# EAGLE design ASD2411 (EAGLE 6.3)
DATABASE: ./../../../../../Components/TinyCircuits_Part_Database.txt
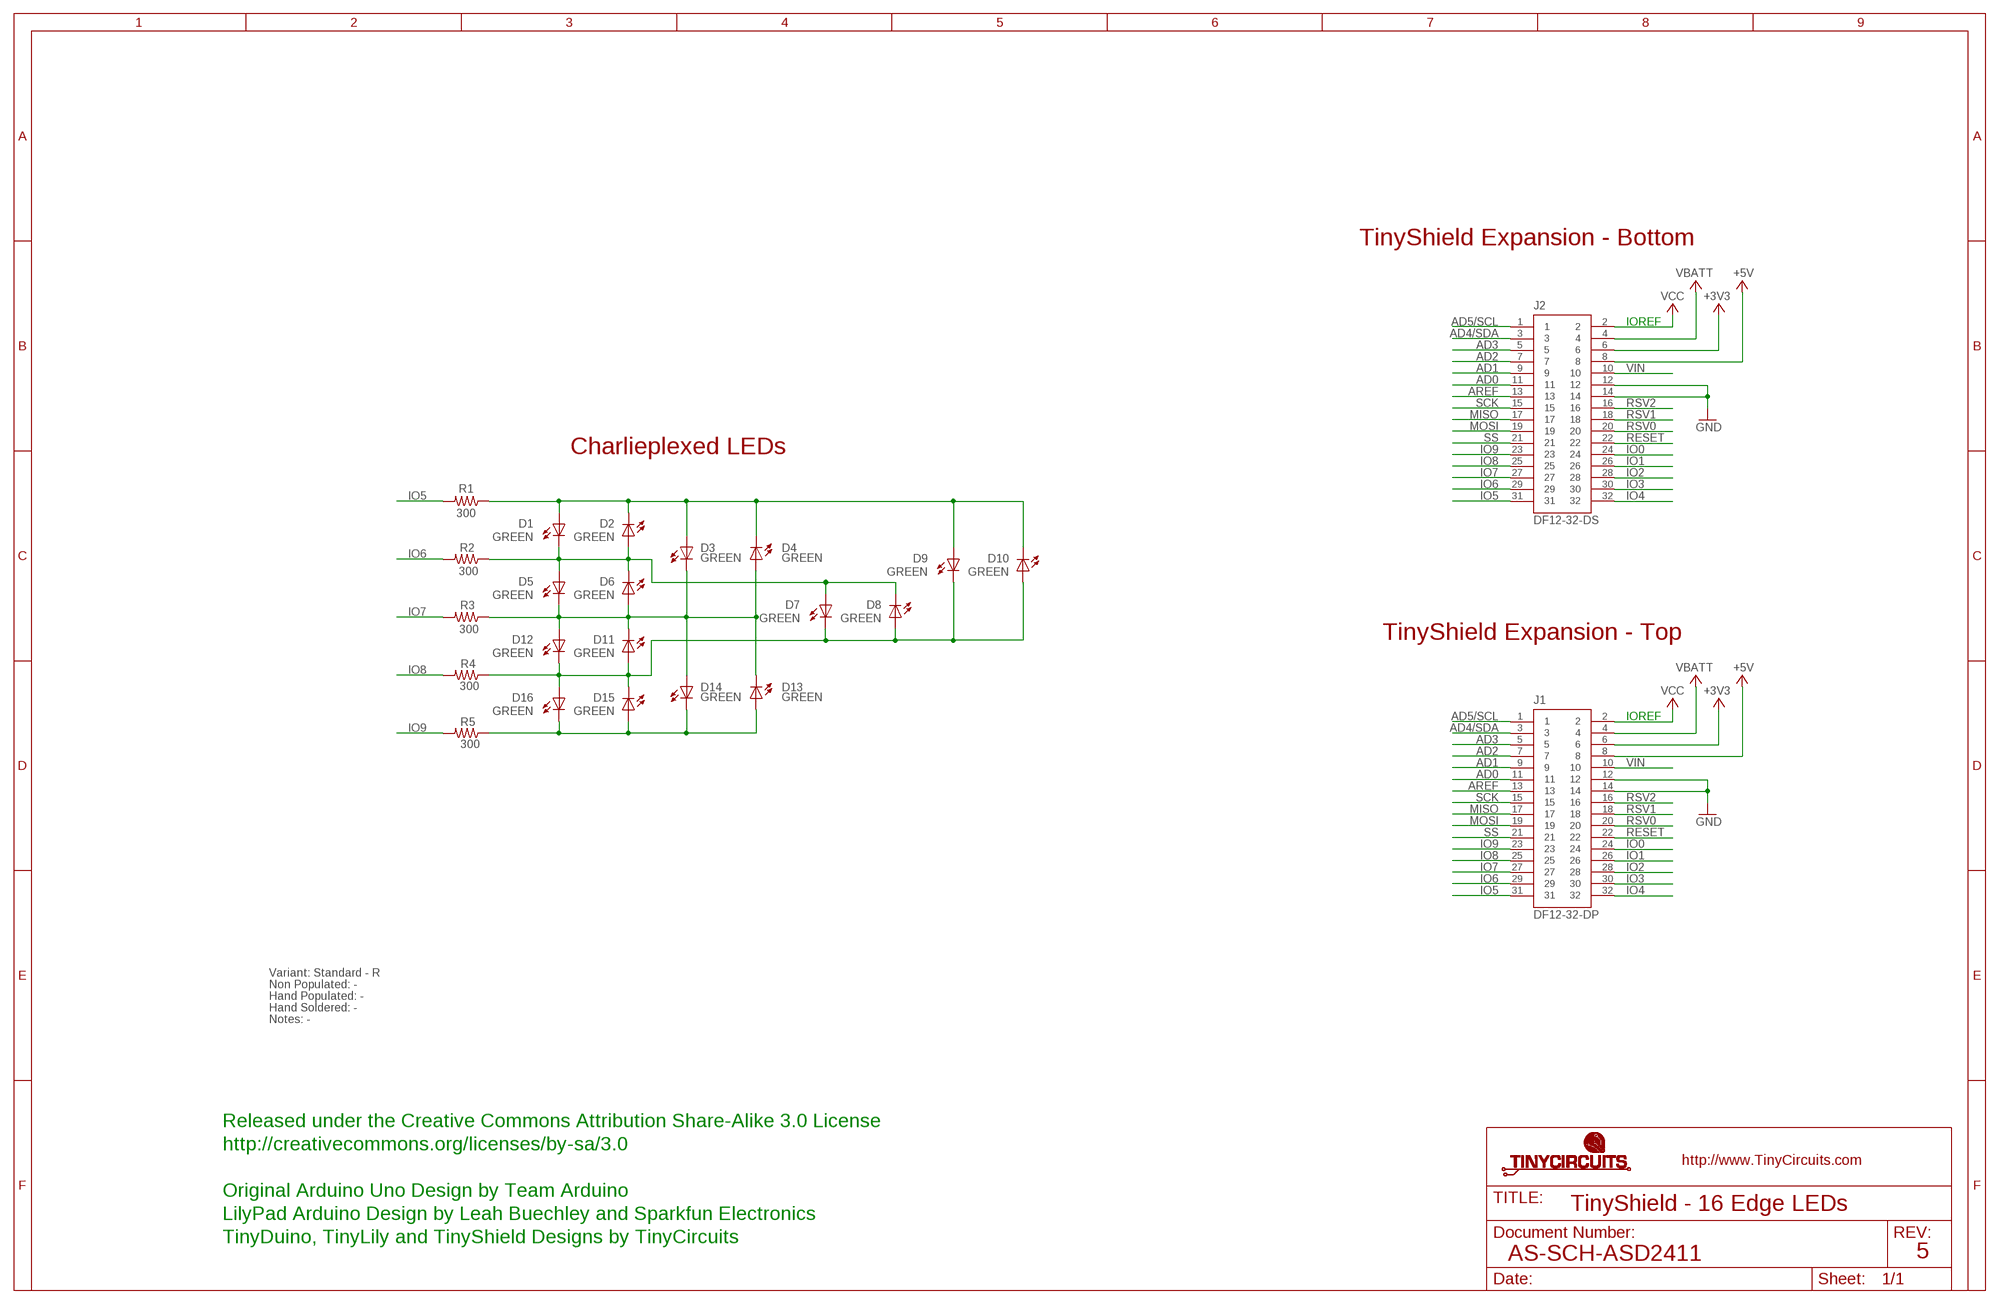
[diagram p0: schematic, sheet 1]

## Parts
D1  GREEN  AS-ITM-00011  [LNJ_LED]
D2  GREEN  AS-ITM-00011  [LNJ_LED]
D3  GREEN  AS-ITM-00011  [LNJ_LED]
D4  GREEN  AS-ITM-00011  [LNJ_LED]
D5  GREEN  AS-ITM-00011  [LNJ_LED]
D6  GREEN  AS-ITM-00011  [LNJ_LED]
D7  GREEN  AS-ITM-00011  [LNJ_LED]
D8  GREEN  AS-ITM-00011  [LNJ_LED]
D9  GREEN  AS-ITM-00011  [LNJ_LED]
D10  GREEN  AS-ITM-00011  [LNJ_LED]
D11  GREEN  AS-ITM-00011  [LNJ_LED]
D12  GREEN  AS-ITM-00011  [LNJ_LED]
D13  GREEN  AS-ITM-00011  [LNJ_LED]
D14  GREEN  AS-ITM-00011  [LNJ_LED]
D15  GREEN  AS-ITM-00011  [LNJ_LED]
D16  GREEN  AS-ITM-00011  [LNJ_LED]
J1  DF12-32-DP  AS-ITM-00015  [DF12-32-DP]
J2  DF12-32-DS  AS-ITM-00012  [DF12-32-DS]
R1  300  AS-ITM-00016  [0402]
R2  300  AS-ITM-00016  [0402]
R3  300  AS-ITM-00016  [0402]
R4  300  AS-ITM-00016  [0402]
R5  300  AS-ITM-00016  [0402]

## Nets
+3V3: J1.6 J2.6
+5V: J1.8 J2.8
AD0: J1.11 J2.11
AD1: J1.9 J2.9
AD2: J1.7 J2.7
AD3: J1.5 J2.5
AD4/SDA: J1.3 J2.3
AD5/SCL: J1.1 J2.1
AREF: J1.13 J2.13
GND: J1.12 J1.14 J2.12 J2.14
IO0: J1.24 J2.24
IO1: J1.26 J2.26
IO2: J1.28 J2.28
IO3: J1.30 J2.30
IO4: J1.32 J2.32
IO5: J1.31 J2.31 R1.2
IO6: J1.29 J2.29 R2.2
IO7: J1.27 J2.27 R3.2
IO8: J1.25 J2.25 R4.2
IO9: J1.23 J2.23 R5.2
MISO: J1.17 J2.17
MOSI: J1.19 J2.19
N$1: D1.C D2.A D5.A D6.C D7.A D8.C R2.1
N$11: D1.A D2.C D3.A D4.C D9.A D10.C R1.1
N$13: D3.C D4.A D5.C D6.A D11.C D12.A D13.C D14.A R3.1
N$14: D7.C D8.A D9.C D10.A D11.A D12.C D15.C D16.A R4.1
N$15: D13.A D14.C D15.A D16.C R5.1
RESET: J1.22 J2.22
RSV0: J1.20 J2.20
RSV1: J1.18 J2.18
RSV2: J1.16 J2.16
SCK: J1.15 J2.15
SS: J1.21 J2.21
VBATT: J1.4 J2.4
VCC: J1.2 J2.2
VIN: J1.10 J2.10

## Notes on the sheet
- TinyShield Expansion - Bottom
- IOREF
- Charlieplexed LEDs
- TinyShield Expansion - Top
- IOREF
- Variant: Standard - R
- Non Populated: -
- Hand Populated: -
- Hand Soldered: -
- Notes: -
- Released under the Creative Commons Attribution Share-Alike 3.0 License
- http://creativecommons.org/licenses/by-sa/3.0
- Original Arduino Uno Design by Team Arduino
- TinyShield - 16 Edge LEDs
- LilyPad Arduino Design by Leah Buechley and Sparkfun Electronics
- TinyDuino, TinyLily and TinyShield Designs by TinyCircuits
- AS-SCH-ASD2411 | 5

## Library data of the parts
D1-D16 = tinycircuits:AS-ITM-00011: LED GREEN SIDE VIEW SMD; PARTNO: AS-ITM-00011; PNPROTATION: 90
J1 = tinycircuits:AS-ITM-00015: CONN HEADER 32POS 3MM SMD 0.5MM; PARTNO: AS-ITM-00015
J2 = tinycircuits:AS-ITM-00012: CONN RECEPT 32POS 3MM SMD 0.5MM; PARTNO: AS-ITM-00012
R1-R5 = tinycircuits:AS-ITM-00016: RES 300 OHM 1/16W 1% 0402; PARTNO: AS-ITM-00016

## Board
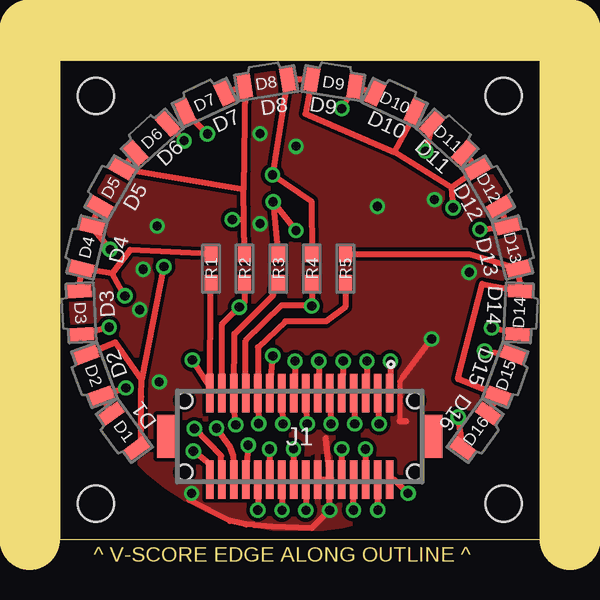
[diagram p1: board, top side]
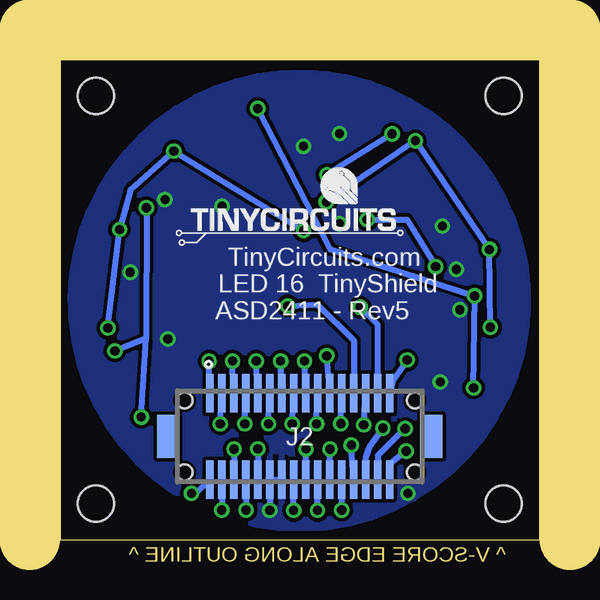
[diagram p2: board, bottom side, seen from below]

Size 20 x 20 mm. Coordinates in mm from the lower left corner, seen from the top.
Outline: 0,20 20,20 20,0 0,0 0,20
Copper layers (1*16): Top 0.035mm / dielectric 1.5mm / Bottom 0.035mm
Design rules "default *": minimum track width 8mil, minimum drill 15mil, track to track 6mil, track to pad 6mil, pad to pad 6mil, via to via 6mil, smd to smd 6mil, copper to edge 6mil, drill to drill 8mil, minimum pad ring 10mil, minimum via ring 5mil, stop-mask expansion 4mil, vias tented up to drill 25mil, thermal gap 10mil
Holes 1.5 mm at 1.5,18.5 18.5,18.5 18.5,1.5 1.5,1.5
tRestrict: 1 lines
bRestrict: 1 lines
Milling: 3 lines

### Footprints (pad centres in the part's own frame; a part is rotated, then mirrored left to right if it is on the bottom)
LNJ_LED = smd 1 x 0.55: A 0,0.9; C 0,-0.9
DF12-32-DP = smd 0.3 x 1.6: 1 -3.75,-1.8; 2 -3.75,1.8; 3 -3.25,-1.8; 4 -3.25,1.8; 5 -2.75,-1.8; 6 -2.75,1.8; 7 -2.25,-1.8; 8 -2.25,1.8; 9 -1.75,-1.8; 10 -1.75,1.8; 11 -1.25,-1.8; 12 -1.25,1.8; 13 -0.75,-1.8; 14 -0.75,1.8; 15 -0.25,-1.8; 16 -0.25,1.8; 17 0.25,-1.8; 18 0.25,1.8; 19 0.75,-1.8; 20 0.75,1.8; 21 1.25,-1.8; 22 1.25,1.8; 23 1.75,-1.8; 24 1.75,1.8; 25 2.25,-1.8; 26 2.25,1.8; 27 2.75,-1.8; 28 2.75,1.8; 29 3.25,-1.8; 30 3.25,1.8; 31 3.75,-1.8; 32 3.75,1.8 | smd 0.9 x 1.8: F1 -5.5,0; F2 5.5,0 | hole 0.65: -4.8,1.5; 4.8,1.5
DF12-32-DS = smd 0.3 x 1.6: 1 -3.75,1.8; 2 -3.75,-1.8; 3 -3.25,1.8; 4 -3.25,-1.8; 5 -2.75,1.8; 6 -2.75,-1.8; 7 -2.25,1.8; 8 -2.25,-1.8; 9 -1.75,1.8; 10 -1.75,-1.8; 11 -1.25,1.8; 12 -1.25,-1.8; 13 -0.75,1.8; 14 -0.75,-1.8; 15 -0.25,1.8; 16 -0.25,-1.8; 17 0.25,1.8; 18 0.25,-1.8; 19 0.75,1.8; 20 0.75,-1.8; 21 1.25,1.8; 22 1.25,-1.8; 23 1.75,1.8; 24 1.75,-1.8; 25 2.25,1.8; 26 2.25,-1.8; 27 2.75,1.8; 28 2.75,-1.8; 29 3.25,1.8; 30 3.25,-1.8; 31 3.75,1.8; 32 3.75,-1.8 | smd 0.9 x 1.8: F1 -5.5,0; F2 5.5,0 | hole 0.65: -4.8,1.5; 4.8,1.5
0402 = smd 0.65 x 0.55: 1 -0.6,0; 2 0.6,0

### Placement (x,y rotation side)
D1  2.66,4.53 36 top
D2  1.41,6.85 20 top
D3  0.86,9.46 3 top
D4  1.11,12.18 346 top
D5  2.12,14.67 330 top
D6  3.82,16.73 312 top
D7  6.03,18.23 295 top
D8  8.6,19.05 279 top
D9  11.4,19.05 261 top
D10  13.97,18.23 245 top
D11  16.18,16.73 228 top
D12  17.88,14.67 210 top
D13  18.89,12.18 194 top
D14  19.14,9.46 177 top
D15  18.59,6.85 160 top
D16  17.34,4.53 144 top
J1  10,4.3 180 top
J2  10,4.3 0 bottom
R1  6.3,11.3 270 top
R2  7.7,11.3 270 top
R3  9.1,11.3 270 top
R4  10.5,11.3 270 top
R5  11.9,11.3 270 top
U$1  [DOCFIELD-TINYCIRCUITS-PCB]  33.91,-10 0 top  (outside the outline)

### Tracks (layer width: path | path; a pad name or v marks a point on that pad's centre or on a via)
+3V3  (via drill 0.38)
  Top 0.254: J2.6 v12.75,3.77 v12.74,3.77
  Bottom 0.254: v12.74,3.77 12.74,2.51 J2.6
+5V  (via drill 0.38)
  Top 0.254: v12.24,1.23 J2.8
  Bottom 0.254: J2.8 12.25,1.21 v12.24,1.23
AD0  (via drill 0.38)
  Top 0.254: v11.3,4.83 11.31,5.05 J2.11
  Bottom 0.254: J2.11 11.28,5.79 v11.3,4.83
AD1  (via drill 0.38)
  Top 0.254: J2.9 11.79,6.27 v11.81,7.44
  Bottom 0.254: v11.81,7.44 11.78,6.22 J2.9
AD2  (via drill 0.38)
  Top 0.254: v12.29,4.83 12.31,5.05 J2.7
  Bottom 0.254: J2.7 12.27,5.86 v12.29,4.83
AD3  (via drill 0.38)
  Top 0.254: J2.5 12.8,6.27 v12.8,7.44
  Bottom 0.254: v12.8,7.44 12.78,6.3 J2.5
AD4/SDA  (via drill 0.38)
  Top 0.254: v13.31,4.83 13.31,5 J2.3
  Bottom 0.254: J2.3 13.28,5.86 v13.31,4.83
AD5/SCL  (via drill 0.38)
  Top 0.254: J2.1 13.78,6.27 v13.78,7.44
  Bottom 0.254: v13.78,7.44 13.78,6.55 J2.1
AREF  (via drill 0.38)
  Top 0.254: J2.13 10.8,6.27 v10.8,7.44
  Bottom 0.254: v10.8,7.44 10.77,6.59 J2.13
GND  (via drill 0.38)
  Top 0.203: 14.3,6.78 14.17,6.59 14.17,4.93
  Top 0.254: J2.12 v11.25,1.21 10.5,0.48 8.85,0.54 8.11,0.6 7.77,0.63 7.09,0.78 5.4,1.64 | J2.12 | J2.12 J2.14 | J2.12 11.09,4.23 | 14.43,4.94 14.17,4.93 | 14.3,6.78 v15.5,8.36
  Bottom 0.254: v11.25,1.21 11.25,1.21 J2.12 J2.14
  other vias: 3.47,11.27 13.24,13.9 15.62,14.18 9.84,16.4 17.07,11.14 8.35,16.92 4.05,13.07 3.32,9.58 5.49,1.93 4.14,6.57 8.35,13.17
  pour Top: 18.49,5.61 arc180 1.54,14.32 arc180
  pour Bottom: 18.49,5.61 arc180 1.54,14.32 arc180
IO0  (via drill 0.38)
  Top 0.254: J2.24 8.25,1.26 v8.25,1.23
  Bottom 0.254: v8.25,1.23 J2.24
IO1  (via drill 0.38)
  Top 0.254: v7.85,3.94 J2.26
  Bottom 0.254: 7.85,3.66 J2.26 v7.85,3.94
IO2  (via drill 0.38)
  Top 0.254: v6.53,4.64 7.07,3.89 7.22,3.49 7.29,2.61 7.26,2.51 J2.28
  Bottom 0.254: J2.28 7.24,3.43 7.07,3.88 v6.53,4.64
IO3  (via drill 0.38)
  Top 0.254: J2.30 6.73,3.49 v5.61,4.63
  Bottom 0.254: v5.61,4.63 6.75,3.51 6.77,2.53 J2.30
IO4  (via drill 0.38)
  Top 0.254: J2.32 6.25,3.14 v5.56,3.69
  Bottom 0.254: v5.56,3.69 5.61,3.65 6.21,3.18 6.21,3.14 6.26,3.1 J2.32
IO5  (via drill 0.38)
  Top 0.254: v5.52,7.49 6.23,6.38 J2.31 6.27,10.57 6.3,10.6 R1.2
  Bottom 0.254: J2.31 6.11,6.64 v5.52,7.49
IO6  (via drill 0.38)
  Top 0.254: J2.29 6.75,8.96 v7.48,9.69 7.7,9.91 R2.2
  Bottom 0.254: J2.29 6.75,8.96 v7.48,9.69
IO7  (via drill 0.38)
  Top 0.254: v7.33,4.78 7.31,4.9 J2.27 7.27,8.57 8.9,10.2 8.9,10.45 R3.2
  Bottom 0.254: J2.27 7.29,5.76 v7.33,4.78
IO8  (via drill 0.38)
  Top 0.254: J2.25 7.75,8.29 9.25,9.78 10.49,9.78 v10.5,9.74 10.5,9.8 R4.2
  Bottom 0.254: v10.5,9.74 9.26,9.79 7.75,8.31 7.75,6.15 | 7.75,6.15 7.77,6.06 7.75,6.04 | J2.25 7.75,6.13 7.75,6.15 | 7.75,6.15 7.74,6.14
IO9  (via drill 0.38)
  Top 0.254: v8.29,4.83 8.31,4.98 J2.23 8.26,6.18 8.26,8.02 9.4,9.1 11.1,9.1 11.9,9.7 R5.2
  Bottom 0.254: J2.23 8.28,5.59 v8.29,4.83
MISO  (via drill 0.38)
  Top 0.254: J2.17 9.8,6.27 v9.8,7.44
  Bottom 0.254: v9.8,7.44 9.76,6.3 J2.17
MOSI  (via drill 0.38)
  Top 0.254: v9.3,4.83 9.31,4.95 J2.19
  Bottom 0.254: J2.19 9.27,5.76 v9.3,4.83
N$1  (via drill 0.38)
  Top 0.254: D6.C D5.A 7.65,14.59 | D1.C 3.39,3.8 3.39,5.97 3.4,6.67 | 3.4,6.67 2.32,8.22 D2.A | 7.65,14.59 R2.1 7.68,13.32 v7.19,13.34 | 7.65,14.59 D8.C D7.A | v4.33,11.38 3.4,6.67
  Bottom 0.254: v7.19,13.34 5.53,13.34 v4.33,11.38
N$11  (via drill 0.38)
  Top 0.254: D1.A D2.C v2.75,6.33 | D3.A D4.C 2.18,11.09 | D10.C D9.A v11.75,17.98 | R1.1 2.92,12.08 2.18,11.09 | v2.71,10.16 2.18,11.09
  Bottom 0.254: v2.75,6.33 v2.71,10.16 8.73,12.11 v11.75,17.98
N$13  (via drill 0.38)
  Top 0.254: D5.C D4.A v2.09,12.1 | D3.C v2.05,8.86 | D6.A v5.18,16.63 | R3.1 v8.89,14.08 v9.84,12.88 | D14.A v18,8.82 | v17.52,12.93 D13.C D12.A | D11.C v15.25,16.2
  Bottom 0.254: v2.05,8.86 v2.09,12.1 v5.18,16.63 v8.89,14.08 | v18,8.82 v17.52,12.93 17.06,14.59 v15.25,16.2 v9.84,12.88
N$14  (via drill 0.38)
  Top 0.254: D7.C v6.15,16.92 | R4.1 10.48,14.11 v8.86,15.21 D8.A D9.C 10.23,17.75 13.94,16.16 | 13.94,16.16 14.82,17.77 D10.A | D11.A D12.C 16.32,14.69 | 16.32,14.69 13.94,16.16 | 16.32,14.69 v16.39,13.84 | v17.71,7.87 D15.C | D16.A v16.61,5.11
  Bottom 0.254: v6.15,16.92 v8.86,15.21 | v16.39,13.84 16.41,8.38 | 16.41,8.38 v17.71,7.87 | v16.61,5.11 16.41,8.38
N$15
  Top 0.254: R5.1 17.08,11.9 D13.A D14.C 17.61,10.66 16.6,6.7 D15.A D16.C
RESET  (via drill 0.38)
  Top 0.254: v8.74,3.77 J2.22
  Bottom 0.254: J2.22 8.75,3.69 v8.74,3.77
RSV0  (via drill 0.38)
  Top 0.254: J2.20 9.25,1.2 v9.26,1.22
  Bottom 0.254: v9.26,1.22 J2.20
RSV1  (via drill 0.38)
  Top 0.254: v9.74,3.77 9.74,2.51 J2.18
  Bottom 0.254: J2.18 9.75,3.72 v9.74,3.77
RSV2  (via drill 0.38)
  Top 0.254: J2.16 10.25,1.16 v10.25,1.22
  Bottom 0.254: v10.25,1.22 J2.16
SCK  (via drill 0.38)
  Top 0.254: v10.31,4.83 10.31,4.98 J2.15
  Bottom 0.254: J2.15 10.29,5.66 v10.31,4.83
SS  (via drill 0.38)
  Top 0.254: J2.21 8.75,6.25 v8.87,7.66
  Bottom 0.254: v8.87,7.66 8.74,6.05 J2.21
VBATT  (via drill 0.38)
  Top 0.254: v13.25,1.23 J2.4
  Bottom 0.254: J2.4 13.25,1.24 v13.25,1.23
VCC  (via drill 0.38)
  Top 0.254: J2.2 13.94,2.5 v14.52,1.93
  Bottom 0.254: v14.52,1.93 14.32,1.93 J2.2
VIN  (via drill 0.38)
  Top 0.254: J2.10 v11.76,3.78 v11.75,3.78
  Bottom 0.254: v11.75,3.78 J2.10

### Text on the board
Dimension: ^ V-SCORE EDGE ALONG OUTLINE ^
tPlace: D8 | D9 | D7 | D10 | D6 | D11 | D12 | D5 | D13 | D4 | D14 | D3 | D15 | D2 | D16 | D1
bPlace: TinyCircuits.com | LED 16 TinyShield | ASD2411 - Rev5
Document: FABRICATION DRAWING | NOTES: | 1. PRINTED CIRCUIT BOARD MADE FROM NEMA GRADE FR-4 EPOXY LAMINATE | WITH 1 OUNCE COPPER PLATING AND .024 THICKNESS. | 2. ALL DIMENSIONS ARE GIVEN IN INCHES. | 3. CIRCUIT PATHS ARE FOR REFERENCE ONLY. | 4. HOLE SIZES SHOWN ARE FINISHED DIAMETERS AFTER PLATING. | 5. BOARD PLATED USING REFLOW OR SIMILAR METHOD. | 6. BOARD TO HAVE BLUE SOLDER MASK ON PLATED SURFACES USING WET FILM | 7. SILKSCREEN BOARD USING WHITE INK. | SR100 OR SR1010 EPOXY. EQUIVALENT WET OR DRY FILM MAY BE USED. | 8. THE FOLLOWING INFORMATION APPLIES TO THIS BOARD: | * 2 COPPER LAYERS | * .024 BOARD THICKNESS | * REQUIRES TOP SIDE SILKSCREEN | Released under the Creative Commons Attribution Share-Alike 3.0 License | http://creativecommons.org/licenses/by-sa/3.0 | Original Arduino Uno Design by Team Arduino | LilyPad Arduino Design by Leah Buechley and Sparkfun Electronics | TinyDuino, TinyLily and TinyShield Designs by TinyCircuits | TinyShield - 16 Edge LEDs | AS-PCB-ASD2411 | 5